# Altium schematic sheet SH4 - CAN.SchDoc
size B
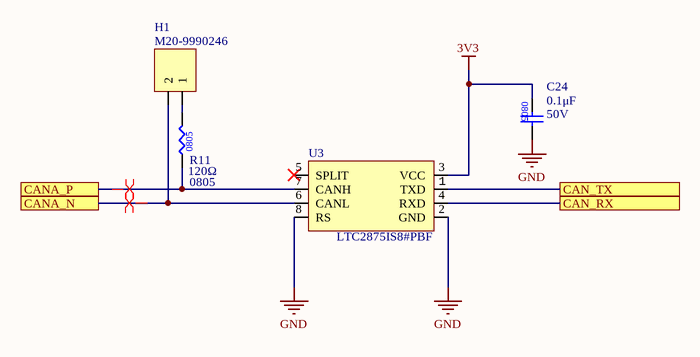
[diagram p0: SH4 - CAN.SchDoc]

## Parts
C24  value 0.1μF  Voltage Rating: 50V  [CAP2012]  (hidden comment: CAP_0.1uF_50V_0805)
H1  Manufacturer Part Number 1: M20-9990246  [HDR1X2]  (hidden comment: JUMPER)
R11  value 120Ω  Package/Footprint: 0805  [RES0805]  (hidden comment: RES_120Ω_0805_1%)
U3  Manufacturer Part Number 1: LTC2875IS8#PBF  [LT-S8_N]  (hidden comment: IC_CAN_TRANSCEIVER)

## Ports
CAN_RX, CAN_TX, CANA_N, CANA_P

## Nets
3V3: C24.1 U3.3(VCC)
GND: C24.2 U3.2(GND) U3.8(RS)
CAN_RX: U3.4(RXD) ; port CAN_RX
CAN_TX: U3.1(TXD) ; port CAN_TX
CANA_N: H1.2 U3.6(CANL) ; port CANA_N
CANA_P: R11.1 U3.7(CANH) ; port CANA_P
NetH1_1: H1.1 R11.2

Not connected (* = marked no-connect by the designer): U3 5(SPLIT)*

## Layout directives
differential pair: CANA_N, CANA_P

## Library data of the parts
C24 = CAP_0.1uF_50V_0805: CAP CER 0.1UF 50V X7R 0805; Manufacturer Part Number 1: GCM21BR71H104KA37K; Manufacturer 1: Murata Electronics; Package/Footprint: 0805; Supplier Part Number 1: 490-8049-1-ND; Supplier 1: Digi-Key; Dielectric: X7R; Mounting Type: SMD; LCSC Part #: C49678
H1 = JUMPER: HEADER 2X1; Manufacturer 1: Harwin Inc.; Package/Footprint: TH; Supplier 1: Digi-Key; Supplier Part Number 1: 952-2262-ND; Mounting Type: TH
R11 = RES_120Ω_0805_1%: RES 120 OHM 1% 1/8W 0805; Manufacturer 1: Vishay; Manufacturer Part Number 1: CRCW0805120RFKEA; Supplier Part Number 1: 541-120CCT-ND; Supplier 1: Digi-Key; Mounting Type: SMD; LCSC Part #: C17437
U3 = IC_CAN_TRANSCEIVER: IC TXRX CAN 4MBPS 8SO; Manufacturer 1: Linear Technologies; Package/Footprint: 8-SOIC; Supplier Part Number 1: LTC2875IS8#PBF-ND; Supplier 1: Digi-Key; Mounting Type: SMD; LCSC Part #: C117076